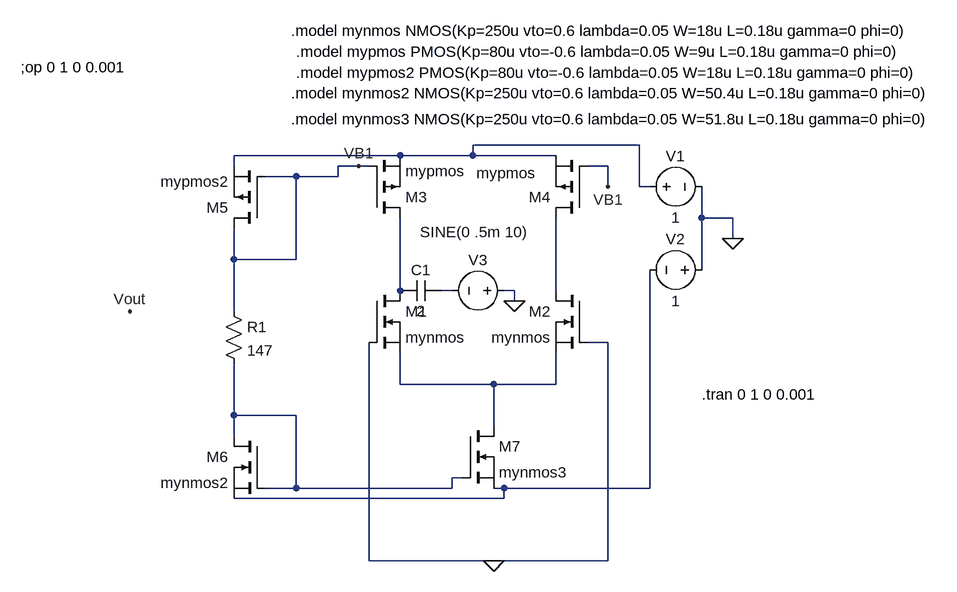
[diagram p0: schematic 4.asc]
4.asc, the LTspice schematic file:
Version 4
SHEET 1 1268 736
WIRE 352 32 96 32
WIRE -16 48 -272 48
WIRE 96 48 96 32
WIRE 96 48 -16 48
WIRE 224 48 96 48
WIRE -272 64 -272 48
WIRE -80 64 -112 64
WIRE -64 64 -80 64
WIRE 304 64 272 64
WIRE -176 80 -224 80
WIRE -112 80 -112 64
WIRE -112 80 -176 80
WIRE 304 96 304 64
WIRE 352 96 352 32
WIRE 368 96 352 96
WIRE 448 144 448 96
WIRE 496 144 448 144
WIRE 496 176 496 144
WIRE -272 208 -272 160
WIRE -176 208 -176 80
WIRE -176 208 -272 208
WIRE 448 224 448 144
WIRE -16 256 -16 144
WIRE 64 256 48 256
WIRE 160 256 144 256
WIRE 224 256 224 144
WIRE 160 272 160 256
WIRE -272 288 -272 208
WIRE 304 336 272 336
WIRE -16 400 -16 352
WIRE 128 400 -16 400
WIRE 224 400 224 352
WIRE 224 400 128 400
WIRE -272 448 -272 368
WIRE -176 448 -272 448
WIRE 128 464 128 400
WIRE -272 480 -272 448
WIRE 80 544 64 544
WIRE -176 560 -176 448
WIRE -176 560 -224 560
WIRE 64 560 64 544
WIRE 64 560 -176 560
WIRE 144 560 128 560
WIRE 368 560 368 224
WIRE 368 560 144 560
WIRE 144 576 144 560
WIRE 144 576 -272 576
WIRE -64 672 -64 336
WIRE 128 672 -64 672
WIRE 304 672 304 336
WIRE 304 672 128 672
FLAG 496 176 0
FLAG 304 96 VB1
FLAG -80 64 VB1
FLAG 128 672 0
FLAG -432 288 Vout
FLAG 160 272 0
DATAFLAG 224 192 ""
DATAFLAG -16 208 ""
DATAFLAG 160 400 ""
DATAFLAG -144 80 ""
DATAFLAG 64 48 ""
DATAFLAG 304 64 ""
DATAFLAG 0 560 ""
SYMBOL nmos -64 256 R0
SYMATTR InstName M1
SYMATTR Value mynmos
SYMBOL nmos 272 256 M0
SYMATTR InstName M2
SYMATTR Value mynmos
SYMBOL pmos -64 144 M180
SYMATTR InstName M3
SYMATTR Value mypmos
SYMBOL pmos 272 144 R180
WINDOW 3 79 69 Left 2
SYMATTR Value mypmos
SYMATTR InstName M4
SYMBOL voltage 352 96 R270
WINDOW 0 32 56 VTop 2
WINDOW 3 -32 56 VBottom 2
WINDOW 123 0 0 Left 0
WINDOW 39 0 0 Left 0
SYMATTR InstName V1
SYMATTR Value 1
SYMBOL voltage 464 224 R90
WINDOW 0 -32 56 VBottom 2
WINDOW 3 32 56 VTop 2
WINDOW 123 0 0 Left 0
WINDOW 39 0 0 Left 0
SYMATTR InstName V2
SYMATTR Value 1
SYMBOL pmos -224 160 R180
SYMATTR InstName M5
SYMATTR Value mypmos2
SYMBOL res -288 272 R0
SYMATTR InstName R1
SYMATTR Value 147
SYMBOL nmos -224 480 M0
SYMATTR InstName M6
SYMATTR Value mynmos2
SYMBOL nmos 80 464 R0
SYMATTR InstName M7
SYMATTR Value mynmos3
SYMBOL voltage 160 256 R90
WINDOW 0 -32 56 VBottom 2
WINDOW 3 -75 62 VBottom 2
WINDOW 123 0 0 Left 0
WINDOW 39 0 0 Left 0
SYMATTR InstName V3
SYMATTR Value SINE(0 .5m 10)
SYMBOL cap 48 240 R90
WINDOW 0 0 32 VBottom 2
WINDOW 3 32 32 VTop 2
SYMATTR InstName C1
SYMATTR Value 2
TEXT -184 -144 Left 2 !.model mynmos NMOS(Kp=250u vto=0.6 lambda=0.05 W=18u L=0.18u gamma=0 phi=0)
TEXT 448 416 Left 2 !.tran 0 1 0 0.001
TEXT -176 -112 Left 2 !.model mypmos PMOS(Kp=80u vto=-0.6 lambda=0.05 W=9u L=0.18u gamma=0 phi=0)
TEXT -176 -80 Left 2 !.model mypmos2 PMOS(Kp=80u vto=-0.6 lambda=0.05 W=18u L=0.18u gamma=0 phi=0)
TEXT -184 -48 Left 2 !.model mynmos2 NMOS(Kp=250u vto=0.6 lambda=0.05 W=50.4u L=0.18u gamma=0 phi=0)
TEXT -600 -88 Left 2 !;op 0 1 0 0.001
TEXT -184 -8 Left 2 !.model mynmos3 NMOS(Kp=250u vto=0.6 lambda=0.05 W=51.8u L=0.18u gamma=0 phi=0)

The netlist it stands for:
* 4.asc
M1 N002 0 N005 N005 mynmos
M2 N004 0 N005 N005 mynmos
M3 N002 VB1 N001 N001 mypmos
M4 N004 VB1 N001 N001 mypmos
V1 N001 0 1
V2 0 N007 1
M5 VB1 VB1 N001 N001 mypmos2
R1 VB1 N006 147
M6 N006 N006 N007 N007 mynmos2
M7 N005 N006 N007 N007 mynmos3
V3 0 N003 SINE(0 .5m 10)
C1 N003 N002 2
.model NMOS NMOS
.model PMOS PMOS
.lib standard.mos
.model mynmos NMOS(Kp=250u vto=0.6 lambda=0.05 W=18u L=0.18u gamma=0 phi=0)
.tran 0 1 0 0.001
.model mypmos PMOS(Kp=80u vto=-0.6 lambda=0.05 W=9u L=0.18u gamma=0 phi=0)
.model mypmos2 PMOS(Kp=80u vto=-0.6 lambda=0.05 W=18u L=0.18u gamma=0 phi=0)
.model mynmos2 NMOS(Kp=250u vto=0.6 lambda=0.05 W=50.4u L=0.18u gamma=0 phi=0)
;op 0 1 0 0.001
.model mynmos3 NMOS(Kp=250u vto=0.6 lambda=0.05 W=51.8u L=0.18u gamma=0 phi=0)
.backanno
.end